# Altium project fsh.PrjPcb
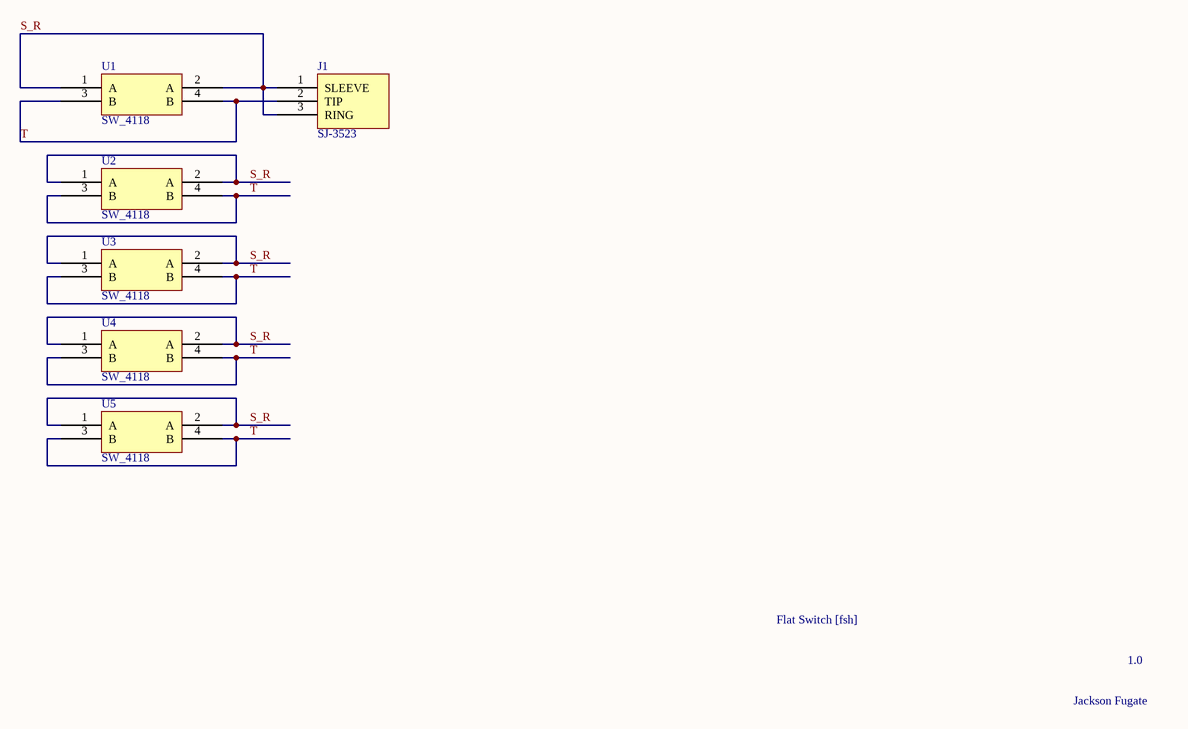
[diagram p0: fsh.SchDoc]
1 sheet, 6 parts. Net scope: global (net labels, ports and power ports of the same name join across sheets).
Board file: fsh.PcbDoc

## Sheet fsh.SchDoc
size Legal; SheetNumber: 1; SheetTotal: 1

### Parts
J1  SJ-3523  [SJ-352X]
U1  SW_4118  [SW_4118_FLAT]
U2  SW_4118  [SW_4118_FLAT]
U3  SW_4118  [SW_4118_FLAT]
U4  SW_4118  [SW_4118_FLAT]
U5  SW_4118  [SW_4118_FLAT]

### Nets
S_R: J1.1(SLEEVE) J1.3(RING) U1.1(A) U1.2(A) U2.1(A) U2.2(A) U3.1(A) U3.2(A) U4.1(A) U4.2(A) U5.1(A) U5.2(A)
T: J1.2(TIP) U1.3(B) U1.4(B) U2.3(B) U2.4(B) U3.3(B) U3.4(B) U4.3(B) U4.4(B) U5.3(B) U5.4(B)

### Notes on the sheet
- Flat Switch [fsh]
- 1.0
- Jackson Fugate